# Altium schematic sheet cs301_Team01_Schematic.SchDoc
size A4; SheetNumber: 1; SheetTotal: 2
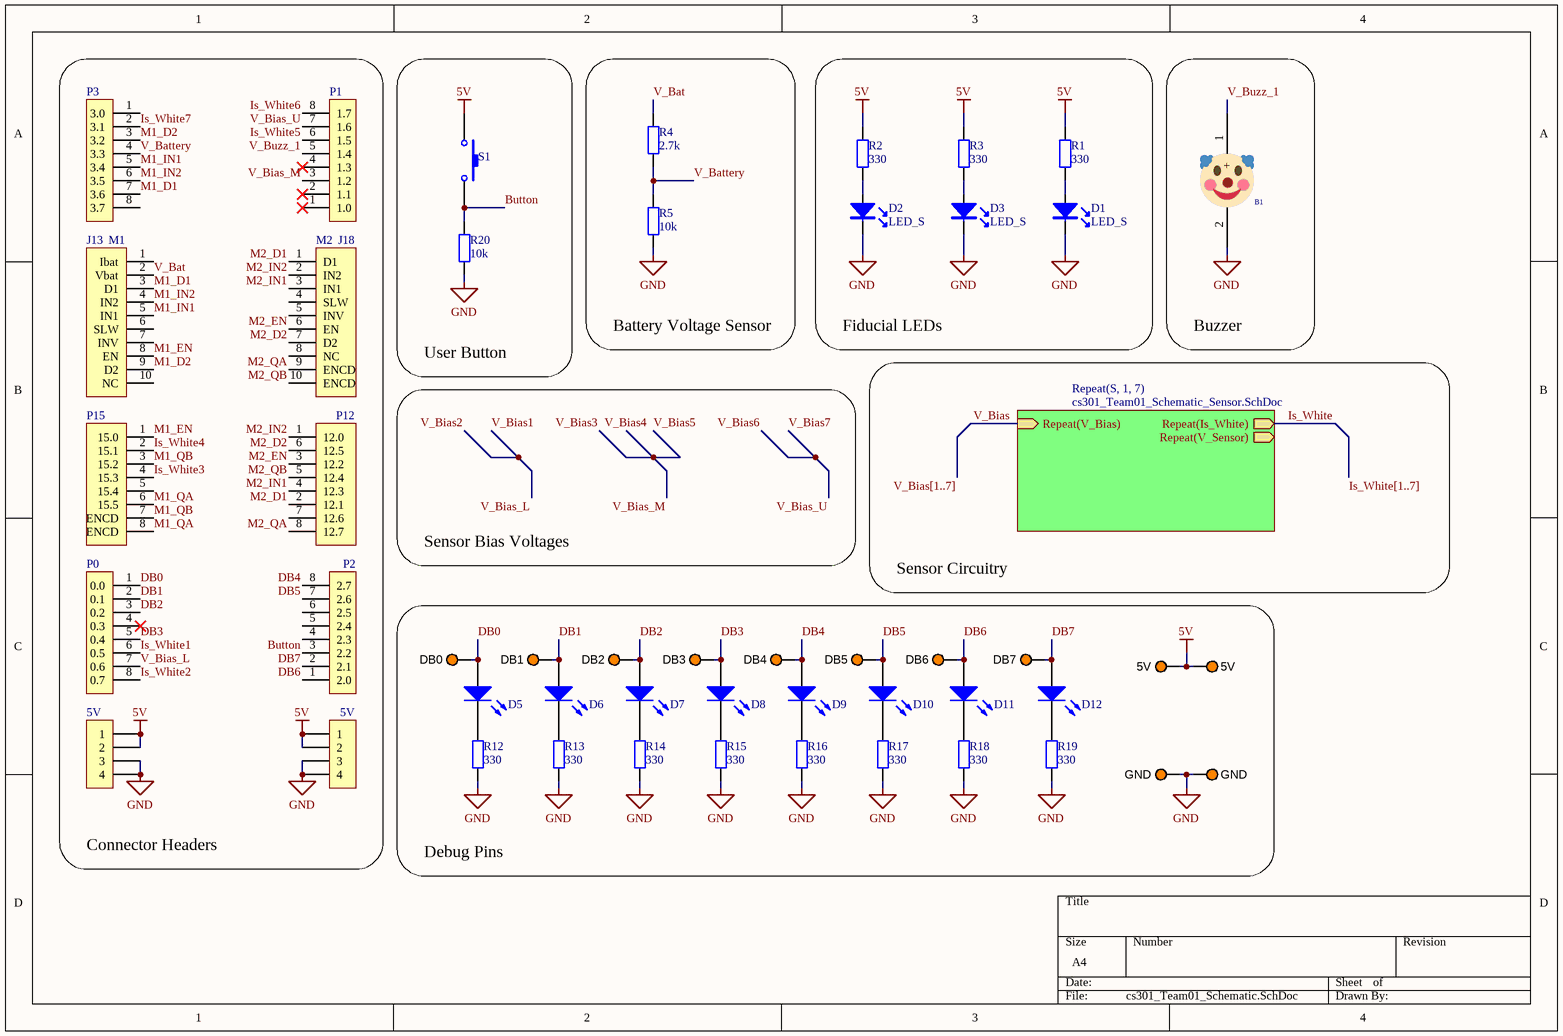
[diagram p0: cs301_Team01_Schematic.SchDoc]

## Parts
5V  5V  [IDC4]  (value not drawn)
5V_1  5V  [TP_TH]
5V_2  5V  [TP_TH]
+5V  5V  [IDC4]
B1  clown  [Buzzer]  (value not drawn)
D1  LED_S  [LED0.1/5MM]
D2  LED_S  [LED0.1/5MM]
D3  LED_S  [LED0.1/5MM]
D5  0  [0805 LED]  (value not drawn)
D6  1  [0805 LED]  (value not drawn)
D7  2  [0805 LED]  (value not drawn)
D8  3  [0805 LED]  (value not drawn)
D9  4  [0805 LED]  (value not drawn)
D10  5  [0805 LED]  (value not drawn)
D11  6  [0805 LED]  (value not drawn)
D12  7  [0805 LED]  (value not drawn)
DB0  5003  [TP_TH]  (value not drawn)
DB1  5003  [TP_TH]  (value not drawn)
DB2  5003  [TP_TH]  (value not drawn)
DB3  5003  [TP_TH]  (value not drawn)
DB4  5003  [TP_TH]  (value not drawn)
DB5  5003  [TP_TH]  (value not drawn)
DB6  5003  [TP_TH]  (value not drawn)
DB7  5003  [TP_TH]  (value not drawn)
GND_1  GND  [TP_TH]
GND_2  GND  [TP_TH]
J13  M1  [idc10]
J18  M2  [IDC10]
P0  P0  [idc8]  (value not drawn)
P1  P1  [idc8]  (value not drawn)
P2  P2  [idc8]  (value not drawn)
P3  P3  [idc8]  (value not drawn)
P12  P12  [idc8]  (value not drawn)
P15  P15  [idc8]  (value not drawn)
R1  330  [0805 RES]
R2  330  [0805 RES]
R3  330  [0805 RES]
R4  2.7k  [0805 RES]
R5  10k  [0805 RES]
R12  330  [0805 RES]
R13  330  [0805 RES]
R14  330  [0805 RES]
R15  330  [0805 RES]
R16  330  [0805 RES]
R17  330  [0805 RES]
R18  330  [0805 RES]
R19  330  [0805 RES]
R20  10k  [0805 RES]
S1  PB switchTH_small  [ece-Sw-small]  (value not drawn)

## Blocks framed on the sheet
Connector Headers: 5V +5V J13 J18 P0-P3 P12 P15
User Button: R20 S1
Battery Voltage Sensor: R4 R5
Fiducial LEDs: D1-D3 R1-R3
Buzzer: B1
Debug Pins: 5V_1 5V_2 D5-D12 DB0-DB7 GND_1 GND_2 R12-R19

## Sub-sheets
Repeat(S, 1, 7) = cs301_Team01_Schematic_Sensor.SchDoc: Repeat(V_Bias) (in), Repeat(Is_White) (out), Repeat(V_Sensor) (out)

## Nets
5V: 5V.1 5V.2 5V_1.1 5V_2.1 +5V.1 +5V.2 R1.2 R2.2 R3.2 S1.1
GND: 5V.3 5V.4 +5V.3 +5V.4 B1.2(-) D1.K D2.K D3.K GND_1.1 GND_2.1 R5.1 R12.1 R13.1 R14.1 R15.1 R16.1 R17.1 R18.1 R19.1 R20.1
Button: P2.3(2.2) R20.2 S1.2
DB0: D5.1(A) DB0.1 P0.1(0.0)
DB1: D6.1(A) DB1.1 P0.2(0.1)
DB2: D7.1(A) DB2.1 P0.3(0.2)
DB3: D8.1(A) DB3.1 P0.5(0.4)
DB4: D9.1(A) DB4.1 P2.8(2.7)
DB5: D10.1(A) DB5.1 P2.7(2.6)
DB6: D11.1(A) DB6.1 P2.1(2.0)
DB7: D12.1(A) DB7.1 P2.2(2.1)
Is_White: sheet Repeat(S, 1, 7)/Repeat(Is_White)
Is_White1: P0.6(0.5)
Is_White2: P0.8(0.7)
Is_White3: P15.4(15.3)
Is_White4: P15.2(15.1)
Is_White5: P1.6(1.5)
Is_White6: P1.8(1.7)
Is_White7: P3.2(3.1)
M1_D1: J13.3(D1) P3.7(3.6)
M1_D2: J13.9(D2) P3.3(3.2)
M1_EN: J13.8(EN) P15.1(15.0)
M1_IN1: J13.5(IN1) P3.5(3.4)
M1_IN2: J13.4(IN2) P3.6(3.5)
M1_QA: P15.6(15.5) P15.8(ENCD)
M1_QB: P15.3(15.2) P15.7(ENCD)
M2_D1: J18.1(D1) P12.2(12.1)
M2_D2: J18.7(D2) P12.6(12.5)
M2_EN: J18.6(EN) P12.3(12.2)
M2_IN1: J18.3(IN1) P12.4(12.3)
M2_IN2: J18.2(IN2) P12.1(12.0)
M2_QA: J18.9(ENCD) P12.8(12.7)
M2_QB: J18.10(ENCD) P12.5(12.4)
V_Bat: J13.2(Vbat) R4.2
V_Battery: P3.4(3.3) R4.1 R5.2
V_Bias: sheet Repeat(S, 1, 7)/Repeat(V_Bias)
V_Bias1: P0.7(0.6)  [also labelled V_Bias2, V_Bias_L]
V_Bias3: P1.3(1.2)  [also labelled V_Bias4, V_Bias5, V_Bias_M]
V_Bias6: P1.7(1.6)  [also labelled V_Bias7, V_Bias_U]
V_Buzz_1: B1.1(+) P1.5(1.4)
NetD1_A: D1.A R1.1
NetD2_A: D2.A R2.1
NetD3_A: D3.A R3.1
NetD5_2: D5.2(K) R12.2
NetD6_2: D6.2(K) R13.2
NetD7_2: D7.2(K) R14.2
NetD8_2: D8.2(K) R15.2
NetD9_2: D9.2(K) R16.2
NetD10_2: D10.2(K) R17.2
NetD11_2: D11.2(K) R18.2
NetD12_2: D12.2(K) R19.2

Not connected (* = marked no-connect by the designer): J13 1(Ibat) 6(SLW) 7(INV) 10(NC); J18 4(SLW) 5(INV) 8(NC); P0 4(0.3)*; P1 1(1.0)* 2(1.1)* 4(1.3)*; P2 4(2.3) 5(2.4) 6(2.5); P3 1(3.0) 8(3.7); P12 7(12.6); P15 5(15.4)

## Buses and harness runs
bus Is_White[1..7]
bus V_Bias[1..7]

## Notes on the sheet
- Sensor Bias Voltages
- Sensor Circuitry

## Library data of the parts
5V +5V = CON4: Connector
5V_1 5V_2 DB0-DB7 GND_1 GND_2 = TestPoint: Test Point, Orange, 1-Pin THD, RoHS; Peak Reverse Current: 600 uA; Forward Current: 3 A; Max Surge Current: 80 A; Forward Voltage: 1.08 V; Max Operating Temperature: 150 degC; PackageReference: 5003; Pins: 2; ComponentLink2URL: http://keyelco.com/userAssets/file/M65p56.pdf; PackageDescription: 1-Pin Through Hole Device, Dia 2.54 mm; Weight: 0.01 lb; Diameter: 5.3 mm; Mount: Through Hole; Package Quantity: 500; Packaging: Bulk; Min Operating Temperature: -65 degC; ComponentLink1Description: Manufacturer URL; Height: 0.25 inch; ComponentLink1URL: http://www.keyelco.com/; ComponentLink2Description: Datasheet; Width: 0.25 inch; REACH SVHC: No SVHC; RoHSCompliant: true; Radiation Hardening: No; Length: 9.5 mm; DatasheetVersion: Jun-15
B1 = Buzzer
D1-D3 = LED
D5-D12 = LED_SMT_0805: SMT LED 0805 size; Manufacturer: Lite-On Inc.; Manufacturer Part Number: LTST-C170KGKT; Color: Green; Lens Color: Colorless; Lens Transparency: Clear; Millicandela Rating: 35mcd; Lens Style/Size: Rectangle with Flat Top, 1.40mm x 1.25mm; Voltage - Forward (Vf) (Typ): 2V; Current - Test: 20mA; Viewing Angle: 130°; Wavelength - Dominant: 571nm; Wavelength - Peak: 574nm; Supplier 1: Digi-Key; RoHS: RoHS Compliant; Category: Optoelectronics; Stock 1: 503069; Pricing 1: 1=0.62, 10=0.459, 25=0.338, 100=0.2415, 250=0.16416, 500=0.14486, 1000=0.11347 (NZD); Packaging: Cut Tape (CT); Part Status: Active; Mounting Type: Surface Mount; Features: -; Package / Case: 0805 (2012 Metric); Size / Dimension: 2.00mm L x 1.25mm W; Height (Max): 1.10mm; ComponentLink1URL: http://optoelectronics.liteon.com/upload/download/DS22-2000-073/LTST-C170KGKT.pdf; ComponentLink1Description: http://optoelectronics.liteon.com/upload/download/DS22-2000-073/LTST-C170KGKT.pdf; Supplier Part Number 1: 160-1414-1-ND
J13 J18 = CON10: Connector
P0-P3 = CON8: Connector
P12 P15 = CON8_1: Connector
R1-R5 R12-R20 = Res_SMT_0805: 0805 resistor; Published: 8-Jun-2000; LatestRevisionDate: 17-Jul-2002; LatestRevisionNote: Re-released for DXP Platform.; PackageReference: AXIAL-0.4; Publisher: Altium Limited; Value: *; ComponentLink1Description: https://nz.mouser.com/datasheet/2/315/AOA0000C304-1149620.pdf
S1 = PB switchTH_small: Push Button Switch thru hole